# Altium schematic sheet Control_Board_SCH.SchDoc
size A4; SheetNumber: 1; SheetTotal: 9
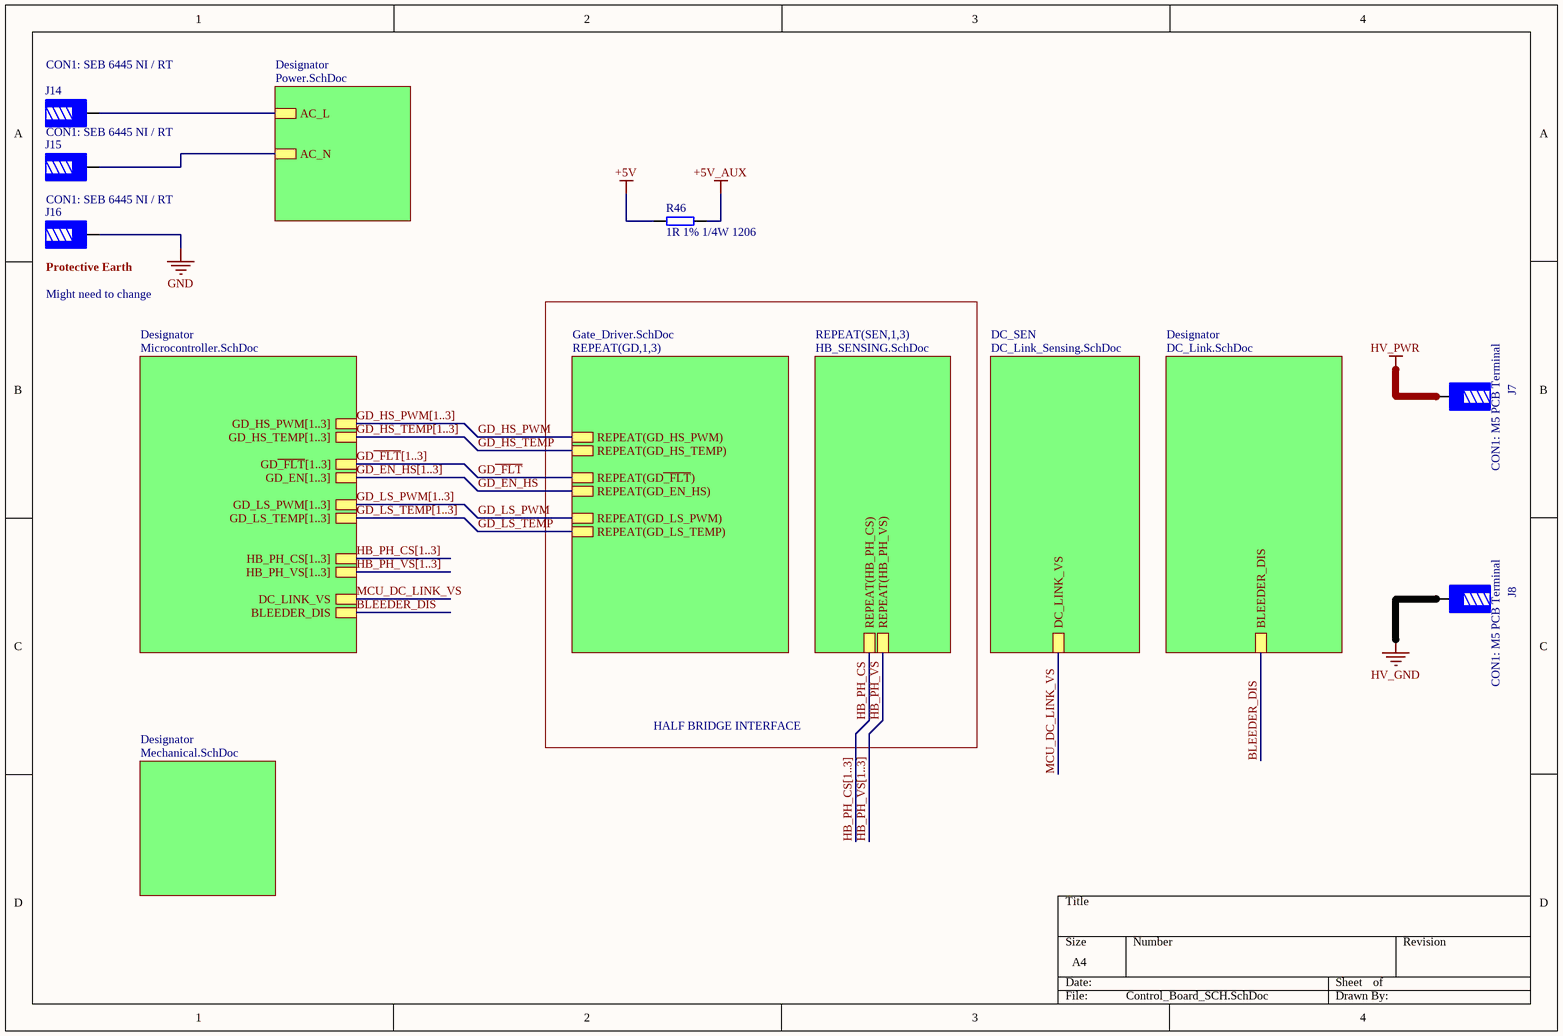
[diagram p0: Control_Board_SCH.SchDoc]

## Parts
J7  CON1: M5 PCB Terminal  [CON1: M5 PCB Terminal-Footprint-1]
J8  CON1: M5 PCB Terminal  [CON1: M5 PCB Terminal-Footprint-1]
J14  CON1: SEB 6445 NI / RT  [CON1: SEB 6445 NI _ RT-Footprint-1]
J15  CON1: SEB 6445 NI / RT  [CON1: SEB 6445 NI _ RT-Footprint-1]
J16  CON1: SEB 6445 NI / RT  [CON1: SEB 6445 NI _ RT-Footprint-1]
R46  1R 1% 1/4W 1206  [RESC3116X06N]

## Sub-sheets
DC_SEN = DC_Link_Sensing.SchDoc: DC_LINK_VS
Designator = Power.SchDoc: AC_L, AC_N
Designator = Microcontroller.SchDoc: GD_HS_PWM[1..3], GD_LS_PWM[1..3], GD_HS_TEMP[1..3], GD_LS_TEMP[1..3], GD~{_FLT}[1..3], GD_EN[1..3], BLEEDER_DIS, DC_LINK_VS, HB_PH_CS[1..3], HB_PH_VS[1..3]
Designator = DC_Link.SchDoc: BLEEDER_DIS
Designator = Mechanical.SchDoc: no entries
REPEAT(GD,1,3) = Gate_Driver.SchDoc: REPEAT(GD_LS_PWM), REPEAT(GD_HS_PWM), REPEAT(GD_HS_TEMP), REPEAT(GD_LS_TEMP), REPEAT(GD~{_FLT}), REPEAT(GD_EN_HS)
REPEAT(SEN,1,3) = HB_SENSING.SchDoc: REPEAT(HB_PH_CS), REPEAT(HB_PH_VS)

## Nets
+5V: R46.1
+5V_AUX: R46.2
GND: J16.1
HV_GND: J8.1
HV_PWR: J7.1
BLEEDER_DIS: sheet Designator/BLEEDER_DIS, sheet Designator/BLEEDER_DIS
GD~{_FLT}: sheet REPEAT(GD,1,3)/REPEAT(GD~{_FLT})
GD_EN_HS: sheet REPEAT(GD,1,3)/REPEAT(GD_EN_HS)
GD_HS_PWM: sheet REPEAT(GD,1,3)/REPEAT(GD_HS_PWM)
GD_HS_TEMP: sheet REPEAT(GD,1,3)/REPEAT(GD_HS_TEMP)
GD_LS_PWM: sheet REPEAT(GD,1,3)/REPEAT(GD_LS_PWM)
GD_LS_TEMP: sheet REPEAT(GD,1,3)/REPEAT(GD_LS_TEMP)
HB_PH_CS: sheet REPEAT(SEN,1,3)/REPEAT(HB_PH_CS)
HB_PH_VS: sheet REPEAT(SEN,1,3)/REPEAT(HB_PH_VS)
MCU_DC_LINK_VS: sheet Designator/DC_LINK_VS, sheet DC_SEN/DC_LINK_VS
NetJ14_1: J14.1 ; sheet Designator/AC_L
NetJ15_1: J15.1 ; sheet Designator/AC_N

## Buses and harness runs
bus GD_EN_HS[1..3] = sheet Designator/GD_EN[1..3]
bus GD_HS_PWM[1..3] = sheet Designator/GD_HS_PWM[1..3]
bus GD_HS_TEMP[1..3] = sheet Designator/GD_HS_TEMP[1..3]
bus GD_LS_PWM[1..3] = sheet Designator/GD_LS_PWM[1..3]
bus GD_LS_TEMP[1..3] = sheet Designator/GD_LS_TEMP[1..3]
bus GD~{_FLT}[1..3] = sheet Designator/GD~{_FLT}[1..3]
bus HB_PH_CS[1..3]
bus HB_PH_CS[1..3] = sheet Designator/HB_PH_CS[1..3]
bus HB_PH_VS[1..3]
bus HB_PH_VS[1..3] = sheet Designator/HB_PH_VS[1..3]

## Notes on the sheet
- Might need to change
- (near J16) Protective Earth
- HALF BRIDGE INTERFACE

## Library data of the parts
J7 J8 = CMP-002-00581-1: Manufacturer: Lab; Manufacturer Part Number: M5 PCB Terminal
J14-J16 = CMP-002-00583-1: Schutzinger Red 4 mm Female Banana Socket Screw 1000 V Nickel Banana Socket; Manufacturer: Schützinger; Voltage Rating (DC): 1kV; Current Rating: 32A; Length: 32mm; Category: Uncategorized; Manufacturer Part Number: SEB 6445 NI / RT; Contact Material: Brass; Color: Red
R46 = CMP-009-00657-1: Res Thick Film 1206 1 Ohm 1% 0.25W(1/4W) ±100ppm/C Pad SMD T/R Automotive AEC-Q200; Manufacturer: Stackpole Electronics; Manufacturer Part Number: RMCF1206FT1R00; Temperature Coefficient: 100ppm/°C; Max Power Dissipation: 125mW; Working Voltage: 150V; Value: 1; ComponentLink29URL: https://datasheet.octopart.com:443/RMCF1206FT10K0-Stackpole-Electronics-datasheet-8324226.pdf?src-supplier=Future+Electronics; ComponentLink11URL: https://datasheet.octopart.com:443/RMCF0805FT10K0-Stackpole-Electronics-datasheet-8359789.pdf?src-supplier=Future+Electronics; ComponentLink1Description: https://datasheet.octopart.com:443/RMCF0805FT10K0-Stackpole-Electronics-datasheet-182148065.pdf?src-supplier=IHS; ComponentLink16URL: http://sigma.octopart.com:80/141158211/reach_statement/Stackpole-Electronics-RMCF0805FT10K0.pdf?src-supplier=Compliance+Statements; ComponentLink16Description: http://sigma.octopart.com:80/141158211/reach_statement/Stackpole-Electronics-RMCF0805FT10K0.pdf?src-supplier=Compliance+Statements; Max Operating Temperature: 155°C; ComponentLink27Description: https://datasheet.octopart.com:443/RMCF1206FT10K0-Stackpole-Electronics-datasheet-11547379.pdf?src-supplier=Future+Electronics; ComponentLink19URL: https://datasheet.octopart.com:443/RMCF1206FT10K0-Stackpole-Electronics-datasheet-141193804.pdf?src-supplier=Master+Electronics; Number of Terminals: 2; ComponentLink31URL: http://sigma.octopart.com:80/141158212/rohs_statement/Stackpole-Electronics-RMCF1206FT10K0.pdf?src-supplier=Compliance+Statements; ComponentLink32Description: http://sigma.octopart.com:80/141158211/reach_statement/Stackpole-Electronics-RMCF1206FT10K0.pdf?src-supplier=Compliance+Statements; ComponentLink20Description: https://datasheet.octopart.com:443/RMCF1206FT10K0-Stackpole-Electronics-datasheet-189104163.pdf?src-supplier=Master+Electronics; ComponentLink7URL: https://datasheet.octopart.com:443/RMCF0805FT10K0-Stackpole-Electronics-datasheet-10788263.pdf?src-supplier=Stackpole+Electronics; ComponentLink4Description: https://datasheet.octopart.com:443/RMCF0805FT10K0-Stackpole-Electronics-datasheet-12510902.pdf?src-supplier=Upverter; ComponentLink21URL: https://datasheet.octopart.com:443/RMCF1206FT10K0-Stackpole-Electronics-datasheet-116606903.pdf?src-supplier=Master+Electronics; ComponentLink27URL: https://datasheet.octopart.com:443/RMCF1206FT10K0-Stackpole-Electronics-datasheet-11547379.pdf?src-supplier=Future+Electronics; ComponentLink10URL: https://datasheet.octopart.com:443/RMCF0805FT10K0-Stackpole-Electronics-datasheet-11547379.pdf?src-supplier=Future+Electronics; ComponentLink8URL: https://datasheet.octopart.com:443/RMCF0805FT10K0-Stackpole-Electronics-datasheet-154799224.pdf?src-supplier=Master+Electronics; Stock: 3420000; Features: Automotive AEC-Q200; Lifecycle Status: Production; Tolerance: 1%; ComponentLink15Description: http://sigma.octopart.com:80/15940719/materials_sheet/Stackpole-Electronics-RMCF0805FT10K0.pdf?src-supplier=Compliance+Statements; ComponentLink12Description: https://datasheet.octopart.com:443/RMCF0805FT10K0-Stackpole-Electronics-datasheet-8324226.pdf?src-supplier=Future+Electronics; ComponentLink18Description: https://datasheet.octopart.com:443/RMCF1206FT10K0-Stackpole-Electronics-datasheet-182148065.pdf?src-supplier=IHS; ComponentLink9URL: https://datasheet.octopart.com:443/RMCF0805FT10K0-Stackpole-Electronics-datasheet-11546843.pdf?src-supplier=Arrow+Electronics; Schedule B: 8533210045, 8533210045; Pricing: 5000=0.00245, 10000=0.00241, 20000=0.00238, 40000=0.00234, 80000=0.0023 (USD); ComponentLink5URL: https://datasheet.octopart.com:443/RMCF0805FT10K0-Stackpole-Electronics-datasheet-141193804.pdf?src-supplier=Stackpole+Electronics; ComponentLink31Description: http://sigma.octopart.com:80/141158212/rohs_statement/Stackpole-Electronics-RMCF1206FT10K0.pdf?src-supplier=Compliance+Statements; Case/Package: 1206; ComponentLink24URL: https://datasheet.octopart.com:443/RMCF1206FT10K0-Stackpole-Electronics-datasheet-12534581.pdf?src-supplier=Stackpole+Electronics; ComponentLink13Description: https://datasheet.octopart.com:443/RMCF0805FT10K0-Stackpole-Electronics-datasheet-8088878.pdf?src-supplier=Future+Electronics; ComponentLink2Description: https://datasheet.octopart.com:443/RMCF0805FT10K0-Stackpole-Electronics-datasheet-12534581.pdf?src-supplier=Upverter; ComponentLink17URL: http://sigma.octopart.com:80/141158212/rohs_statement/Stackpole-Electronics-RMCF0805FT10K0.pdf?src-supplier=Compliance+Statements; Depth: 1.25mm; ComponentLink3URL: https://datasheet.octopart.com:443/RMCF0805FT10K0-Stackpole-Electronics-datasheet-28504820.pdf?src-supplier=Upverter; ComponentLink21Description: https://datasheet.octopart.com:443/RMCF1206FT10K0-Stackpole-Electronics-datasheet-116606903.pdf?src-supplier=Master+Electronics; ComponentLink32URL: http://sigma.octopart.com:80/141158211/reach_statement/Stackpole-Electronics-RMCF1206FT10K0.pdf?src-supplier=Compliance+Statements; ComponentLink4URL: https://datasheet.octopart.com:443/RMCF0805FT10K0-Stackpole-Electronics-datasheet-12510902.pdf?src-supplier=Upverter; ComponentLink26Description: https://datasheet.octopart.com:443/RMCF1206FT10K0-Stackpole-Electronics-datasheet-11546843.pdf?src-supplier=Arrow+Electronics; ComponentLink15URL: http://sigma.octopart.com:80/15940719/materials_sheet/Stackpole-Electronics-RMCF0805FT10K0.pdf?src-supplier=Compliance+Statements; ComponentLink18URL: https://datasheet.octopart.com:443/RMCF1206FT10K0-Stackpole-Electronics-datasheet-182148065.pdf?src-supplier=IHS; ComponentLink22URL: https://datasheet.octopart.com:443/RMCF1206FT10K0-Stackpole-Electronics-datasheet-62091608.pdf?src-supplier=Upverter; ComponentLink28URL: https://datasheet.octopart.com:443/RMCF1206FT10K0-Stackpole-Electronics-datasheet-8359789.pdf?src-supplier=Future+Electronics; Voltage Rating: 150V; ComponentLink29Description: https://datasheet.octopart.com:443/RMCF1206FT10K0-Stackpole-Electronics-datasheet-8324226.pdf?src-supplier=Future+Electronics; ComponentLink14URL: https://datasheet.octopart.com:443/RMCF0805FT10K0-Stackpole-Electronics-datasheet-5313682.pdf?src-supplier=Future+Electronics; Radiation Hardening: No; ComponentLink2URL: https://datasheet.octopart.com:443/RMCF0805FT10K0-Stackpole-Electronics-datasheet-12534581.pdf?src-supplier=Upverter; Packaging: Cut Tape (CT); Contact Plating: Tin; ComponentLink3Description: https://datasheet.octopart.com:443/RMCF0805FT10K0-Stackpole-Electronics-datasheet-28504820.pdf?src-supplier=Upverter; China RoHS: Non-Compliant; ComponentLink6Description: https://datasheet.octopart.com:443/RMCF0805FT10K0-Stackpole-Electronics-datasheet-62091608.pdf?src-supplier=Stackpole+Electronics; Source: MasterLibrary_SCH.SchLib; Power Rating: 125mW; ComponentLink19Description: https://datasheet.octopart.com:443/RMCF1206FT10K0-Stackpole-Electronics-datasheet-141193804.pdf?src-supplier=Master+Electronics; REACH SVHC: Yes; ComponentLink8Description: https://datasheet.octopart.com:443/RMCF0805FT10K0-Stackpole-Electronics-datasheet-154799224.pdf?src-supplier=Master+Electronics; ComponentLink22Description: https://datasheet.octopart.com:443/RMCF1206FT10K0-Stackpole-Electronics-datasheet-62091608.pdf?src-supplier=Upverter; ComponentLink12URL: https://datasheet.octopart.com:443/RMCF0805FT10K0-Stackpole-Electronics-datasheet-8324226.pdf?src-supplier=Future+Electronics; ComponentLink26URL: https://datasheet.octopart.com:443/RMCF1206FT10K0-Stackpole-Electronics-datasheet-11546843.pdf?src-supplier=Arrow+Electronics; ComponentLink7Description: https://datasheet.octopart.com:443/RMCF0805FT10K0-Stackpole-Electronics-datasheet-10788263.pdf?src-supplier=Stackpole+Electronics; Military Standard: Not; ComponentLink30URL: http://sigma.octopart.com:80/15940719/materials_sheet/Stackpole-Electronics-RMCF1206FT10K0.pdf?src-supplier=Compliance+Statements; ComponentLink20URL: https://datasheet.octopart.com:443/RMCF1206FT10K0-Stackpole-Electronics-datasheet-189104163.pdf?src-supplier=Master+Electronics; ComponentLink9Description: https://datasheet.octopart.com:443/RMCF0805FT10K0-Stackpole-Electronics-datasheet-11546843.pdf?src-supplier=Arrow+Electronics; ComponentLink5Description: https://datasheet.octopart.com:443/RMCF0805FT10K0-Stackpole-Electronics-datasheet-141193804.pdf?src-supplier=Stackpole+Electronics; Number of Terminations: 2; ComponentLink6URL: https://datasheet.octopart.com:443/RMCF0805FT10K0-Stackpole-Electronics-datasheet-62091608.pdf?src-supplier=Stackpole+Electronics; Min Operating Temperature: -55°C; ComponentLink24Description: https://datasheet.octopart.com:443/RMCF1206FT10K0-Stackpole-Electronics-datasheet-12534581.pdf?src-supplier=Stackpole+Electronics; ComponentLink11Description: https://datasheet.octopart.com:443/RMCF0805FT10K0-Stackpole-Electronics-datasheet-8359789.pdf?src-supplier=Future+Electronics; ComponentLink10Description: https://datasheet.octopart.com:443/RMCF0805FT10K0-Stackpole-Electronics-datasheet-11547379.pdf?src-supplier=Future+Electronics; Design Item ID: 1R 1% 1/4W 1206; ComponentLink25Description: https://datasheet.octopart.com:443/RMCF1206FT10K0-Stackpole-Electronics-datasheet-10788263.pdf?src-supplier=Stackpole+Electronics; Composition: Thick Film; Length: 2mm; Mounting Technology: Surface Mount; ComponentLink17Description: http://sigma.octopart.com:80/141158212/rohs_statement/Stackpole-Electronics-RMCF0805FT10K0.pdf?src-supplier=Compliance+Statements; ComponentLink28Description: https://datasheet.octopart.com:443/RMCF1206FT10K0-Stackpole-Electronics-datasheet-8359789.pdf?src-supplier=Future+Electronics; ComponentLink23URL: https://datasheet.octopart.com:443/RMCF1206FT10K0-Stackpole-Electronics-datasheet-28504820.pdf?src-supplier=Upverter; ComponentLink14Description: https://datasheet.octopart.com:443/RMCF0805FT10K0-Stackpole-Electronics-datasheet-5313682.pdf?src-supplier=Future+Electronics; Height: 500µm; Power Dissipation: 125mW; Width: 1.25mm; RoHS: Compliant; Lead Free: Lead Free; ComponentLink25URL: https://datasheet.octopart.com:443/RMCF1206FT10K0-Stackpole-Electronics-datasheet-10788263.pdf?src-supplier=Stackpole+Electronics; Case Code (Metric): 3216; ComponentLink23Description: https://datasheet.octopart.com:443/RMCF1206FT10K0-Stackpole-Electronics-datasheet-28504820.pdf?src-supplier=Upverter; ComponentLink30Description: http://sigma.octopart.com:80/15940719/materials_sheet/Stackpole-Electronics-RMCF1206FT10K0.pdf?src-supplier=Compliance+Statements; ComponentLink13URL: https://datasheet.octopart.com:443/RMCF0805FT10K0-Stackpole-Electronics-datasheet-8088878.pdf?src-supplier=Future+Electronics; ComponentLink1URL: https://datasheet.octopart.com:443/RMCF0805FT10K0-Stackpole-Electronics-datasheet-182148065.pdf?src-supplier=IHS; Category: Chip SMD Resistors